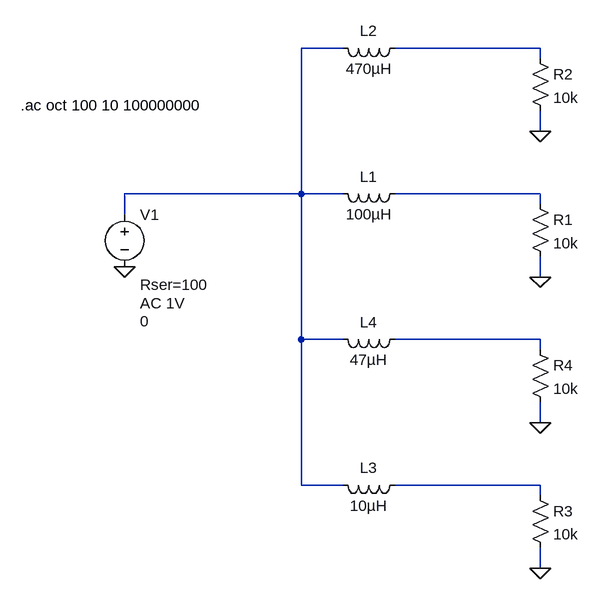
[diagram p0: schematic LR_1order_lowpass.asc]
LR_1order_lowpass.asc, the LTspice schematic file:
Version 4
SHEET 1 880 680
WIRE 368 -224 304 -224
WIRE 672 -224 448 -224
WIRE 672 -208 672 -224
WIRE 672 -96 672 -128
WIRE 304 0 304 -224
WIRE 304 0 32 0
WIRE 368 0 304 0
WIRE 672 0 448 0
WIRE 672 16 672 0
WIRE 32 32 32 0
WIRE 672 128 672 96
WIRE 304 224 304 0
WIRE 368 224 304 224
WIRE 672 224 448 224
WIRE 672 240 672 224
WIRE 672 352 672 320
WIRE 304 448 304 224
WIRE 368 448 304 448
WIRE 672 448 448 448
WIRE 672 464 672 448
WIRE 672 576 672 544
FLAG 32 112 0
FLAG 672 128 0
FLAG 672 -96 0
FLAG 672 576 0
FLAG 672 352 0
SYMBOL voltage 32 16 R0
WINDOW 3 24 180 Left 2
WINDOW 123 24 152 Left 2
WINDOW 39 24 124 Left 2
SYMATTR InstName V1
SYMATTR Value 0
SYMATTR Value2 AC 1V
SYMATTR SpiceLine Rser=100
SYMBOL ind 464 -16 R90
WINDOW 0 5 56 VBottom 2
WINDOW 3 32 56 VTop 2
SYMATTR InstName L1
SYMATTR Value 100µH
SYMBOL res 656 0 R0
SYMATTR InstName R1
SYMATTR Value 10k
SYMBOL ind 464 -240 R90
WINDOW 0 5 56 VBottom 2
WINDOW 3 32 56 VTop 2
SYMATTR InstName L2
SYMATTR Value 470µH
SYMBOL res 656 -224 R0
SYMATTR InstName R2
SYMATTR Value 10k
SYMBOL ind 464 432 R90
WINDOW 0 5 56 VBottom 2
WINDOW 3 32 56 VTop 2
SYMATTR InstName L3
SYMATTR Value 10µH
SYMBOL res 656 448 R0
SYMATTR InstName R3
SYMATTR Value 10k
SYMBOL ind 464 208 R90
WINDOW 0 5 56 VBottom 2
WINDOW 3 32 56 VTop 2
SYMATTR InstName L4
SYMATTR Value 47µH
SYMBOL res 656 224 R0
SYMATTR InstName R4
SYMATTR Value 10k
TEXT -128 -136 Left 2 !.ac oct 100 10 100000000

The netlist it stands for:
* LR_1order_lowpass.asc
V1 N001 0 0 AC 1V Rser=100
L1 N003 N001 100µH
R1 N003 0 10k
L2 N002 N001 470µH
R2 N002 0 10k
L3 N005 N001 10µH
R3 N005 0 10k
L4 N004 N001 47µH
R4 N004 0 10k
.ac oct 100 10 100000000
.backanno
.end